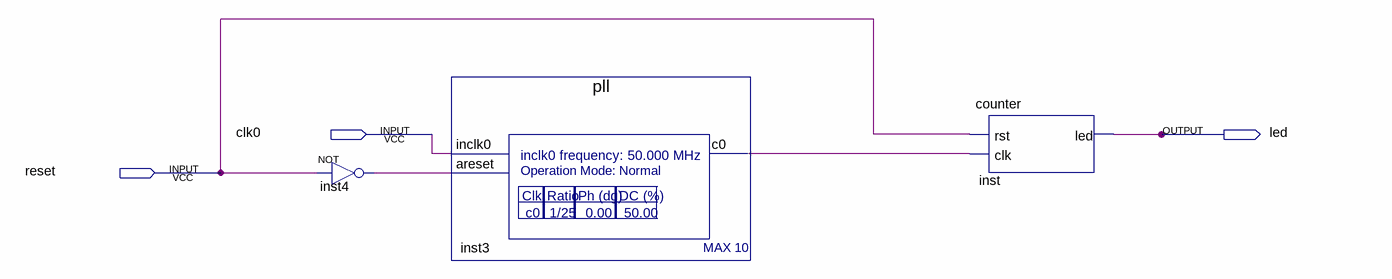
[diagram p0: schematic sheet]
// Quartus schematic first_fpga.bdf as structural Verilog: 3 symbols, 3 pins
module first_fpga (
  input  clk0,
  input  reset,
  output led
);

  wire inst3_c0, inst4_out;

  not inst4 (inst4_out, reset);
  pll inst3 (.inclk0(clk0), .areset(inst4_out), .c0(inst3_c0));
  counter inst (.rst(reset), .clk(inst3_c0), .led(led));
endmodule
